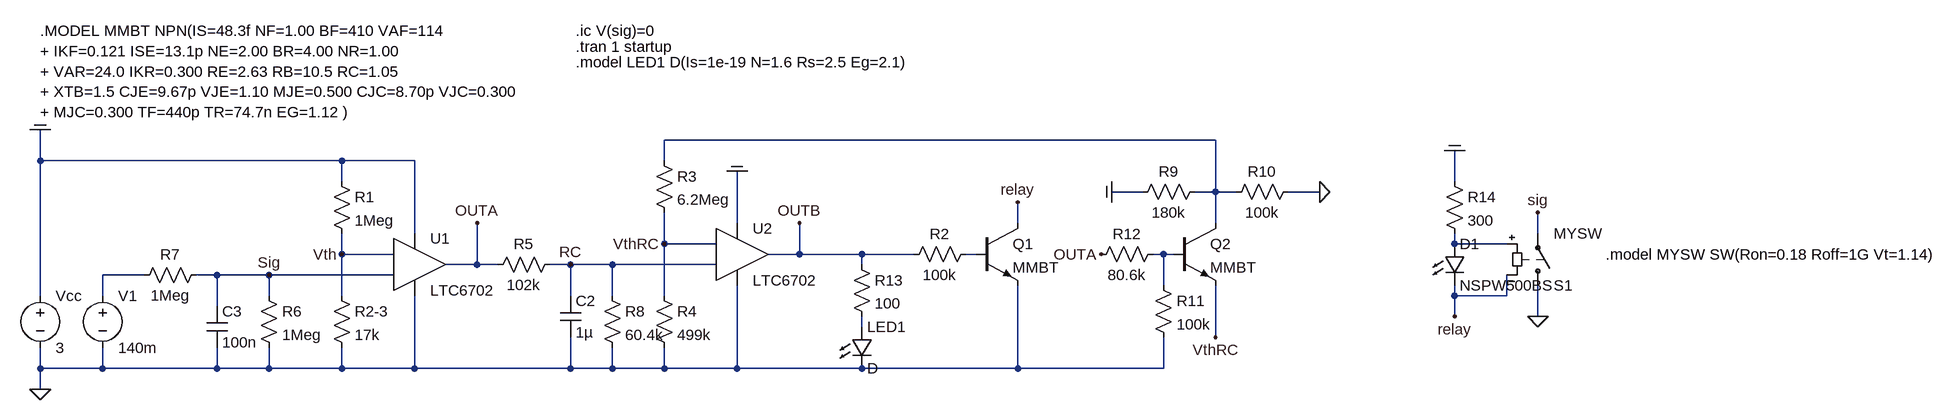
[diagram p0: schematic Windchill01.asc]
Windchill01.asc, the LTspice schematic file:
Version 4
SHEET 1 2700 680
WIRE 1456 -48 608 -48
WIRE -352 -16 -352 -64
WIRE 112 -16 -352 -16
WIRE 224 -16 112 -16
WIRE 608 -16 608 -48
WIRE 112 16 112 -16
WIRE 1824 16 1824 -32
WIRE 1344 32 1296 32
WIRE 1456 32 1456 -48
WIRE 1456 32 1424 32
WIRE 1488 32 1456 32
WIRE 1616 32 1568 32
WIRE 720 80 720 0
WIRE 1152 80 1152 48
WIRE 1456 80 1456 32
WIRE 224 96 224 -16
WIRE 1952 96 1952 64
WIRE 608 112 608 64
WIRE 688 112 608 112
WIRE 1824 112 1824 96
WIRE 1904 112 1824 112
WIRE 112 128 112 96
WIRE 192 128 112 128
WIRE 816 128 816 80
WIRE 816 128 768 128
WIRE 912 128 816 128
WIRE 992 128 912 128
WIRE 1088 128 1072 128
WIRE 1376 128 1360 128
WIRE 1392 128 1376 128
WIRE 320 144 320 80
WIRE 320 144 272 144
WIRE 352 144 320 144
WIRE 464 144 432 144
WIRE 528 144 464 144
WIRE 688 144 528 144
WIRE 912 144 912 128
WIRE -192 160 -256 160
WIRE -80 160 -112 160
WIRE 0 160 -80 160
WIRE 192 160 0 160
WIRE 1376 176 1376 128
WIRE -352 192 -352 -16
WIRE -256 192 -256 160
WIRE 0 192 0 160
WIRE 112 192 112 128
WIRE 464 192 464 144
WIRE 528 192 528 144
WIRE 608 192 608 112
WIRE 1824 192 1824 176
WIRE 1904 192 1904 160
WIRE 1904 192 1824 192
WIRE -80 208 -80 160
WIRE 1824 224 1824 192
WIRE 1952 224 1952 176
WIRE 912 240 912 224
WIRE 1456 256 1456 176
WIRE -352 304 -352 272
WIRE -256 304 -256 272
WIRE -256 304 -352 304
WIRE -80 304 -80 272
WIRE -80 304 -256 304
WIRE 0 304 0 272
WIRE 0 304 -80 304
WIRE 112 304 112 272
WIRE 112 304 0 304
WIRE 224 304 224 192
WIRE 224 304 112 304
WIRE 464 304 464 256
WIRE 464 304 224 304
WIRE 528 304 528 272
WIRE 528 304 464 304
WIRE 608 304 608 272
WIRE 608 304 528 304
WIRE 720 304 720 176
WIRE 720 304 608 304
WIRE 912 304 720 304
WIRE 1152 304 1152 176
WIRE 1152 304 912 304
WIRE 1376 304 1376 256
WIRE 1376 304 1152 304
WIRE -352 336 -352 304
FLAG -352 -64 COM
FLAG -352 336 0
FLAG 112 128 Vth
FLAG 608 112 VthRC
FLAG 0 160 Sig
FLAG 1456 256 VthRC
FLAG 320 80 OUTA
FLAG 816 80 OUTB
FLAG 1280 128 OUTA
FLAG 464 144 RC
FLAG 1616 32 0
FLAG 1296 32 COM
FLAG 720 0 COM
FLAG 1152 48 relay
FLAG 1952 224 0
FLAG 1952 64 sig
FLAG 1824 224 relay
FLAG 1824 -32 COM
SYMBOL cap 448 192 R0
SYMATTR InstName C2
SYMATTR Value 1µ
SYMBOL res 96 0 R0
SYMATTR InstName R1
SYMATTR Value 1Meg
SYMBOL res 96 176 R0
SYMATTR InstName R2-3
SYMATTR Value 17k
SYMBOL voltage -352 176 R0
WINDOW 123 0 0 Left 2
WINDOW 39 0 0 Left 2
SYMATTR InstName Vcc
SYMATTR Value 3
SYMBOL res 592 -32 R0
SYMATTR InstName R3
SYMATTR Value 6.2Meg
SYMBOL res 592 176 R0
SYMATTR InstName R4
SYMATTR Value 499k
SYMBOL res 336 160 R270
WINDOW 0 32 56 VTop 2
WINDOW 3 0 56 VBottom 2
SYMATTR InstName R5
SYMATTR Value 102k
SYMBOL Comparators\\LTC6702 224 144 R0
SYMATTR InstName U1
SYMBOL Comparators\\LTC6702 720 128 R0
SYMATTR InstName U2
SYMBOL Infineon-RFTransistor-SPICE.lib-SM-v02_10-EN\\npn 1088 80 R0
SYMATTR InstName Q1
SYMATTR Value MMBT
SYMBOL res 976 144 R270
WINDOW 0 32 56 VTop 2
WINDOW 3 0 56 VBottom 2
SYMATTR InstName R2
SYMATTR Value 100k
SYMBOL voltage -256 176 R0
WINDOW 123 0 0 Left 2
WINDOW 39 0 0 Left 2
SYMATTR InstName V1
SYMATTR Value 140m
SYMBOL res -208 176 R270
WINDOW 0 32 56 VTop 2
WINDOW 3 0 56 VBottom 2
SYMATTR InstName R7
SYMATTR Value 1Meg
SYMBOL cap -96 208 R0
SYMATTR InstName C3
SYMATTR Value 100n
SYMBOL res -16 176 R0
SYMATTR InstName R6
SYMATTR Value 1Meg
SYMBOL Infineon-RFTransistor-SPICE.lib-SM-v02_10-EN\\npn 1392 80 R0
SYMATTR InstName Q2
SYMATTR Value MMBT
SYMBOL res 1328 48 R270
WINDOW 0 32 56 VTop 2
WINDOW 3 0 56 VBottom 2
SYMATTR InstName R9
SYMATTR Value 180k
SYMBOL res 1472 48 R270
WINDOW 0 32 56 VTop 2
WINDOW 3 0 56 VBottom 2
SYMATTR InstName R10
SYMATTR Value 100k
SYMBOL res 512 176 R0
SYMATTR InstName R8
SYMATTR Value 60.4k
SYMBOL res 1360 160 R0
SYMATTR InstName R11
SYMATTR Value 100k
SYMBOL res 1264 144 R270
WINDOW 0 32 56 VTop 2
WINDOW 3 0 56 VBottom 2
SYMATTR InstName R12
SYMATTR Value 80.6k
SYMBOL LED 896 240 R0
SYMATTR InstName LED1
SYMBOL res 896 128 R0
SYMATTR InstName R13
SYMATTR Value 100
SYMBOL sw 1952 192 M180
SYMATTR InstName S1
SYMATTR Value MYSW
SYMBOL LED 1808 112 R0
SYMATTR InstName D1
SYMATTR Value NSPW500BS
SYMBOL res 1808 0 R0
SYMATTR InstName R14
SYMATTR Value 300
TEXT 472 -192 Left 2 !.tran 1 startup
TEXT -352 -216 Left 2 !.MODEL MMBT NPN(IS=48.3f NF=1.00 BF=410 VAF=114\n+ IKF=0.121 ISE=13.1p NE=2.00 BR=4.00 NR=1.00\n+ VAR=24.0 IKR=0.300 RE=2.63 RB=10.5 RC=1.05\n+ XTB=1.5 CJE=9.67p VJE=1.10 MJE=0.500 CJC=8.70p VJC=0.300\n+ MJC=0.300 TF=440p TR=74.7n EG=1.12 )
TEXT 472 -216 Left 2 !.ic V(sig)=0
TEXT 472 -168 Left 2 !.model LED1 D(Is=1e-19 N=1.6 Rs=2.5 Eg=2.1)
TEXT 2056 128 Left 2 !.model MYSW SW(Ron=0.18 Roff=1G Vt=1.14)

The netlist it stands for:
* Windchill01.asc
C2 RC 0 1µ
R1 COM Vth 1Meg
R2-3 Vth 0 17k
Vcc COM 0 3
R3 N001 VthRC 6.2Meg
R4 VthRC 0 499k
R5 OUTA RC 102k
XU1 Sig Vth COM 0 OUTA LTC6702
XU2 RC VthRC COM 0 OUTB LTC6702
Q1 relay N003 0 0 MMBT
R2 OUTB N003 100k
V1 N005 0 140m
R7 N005 Sig 1Meg
C3 Sig 0 100n
R6 Sig 0 1Meg
Q2 N001 N004 VthRC 0 MMBT
R9 COM N001 180k
R10 N001 0 100k
R8 RC 0 60.4k
R11 N004 0 100k
R12 OUTA N004 80.6k
D§LED1 N006 0 D
R13 OUTB N006 100
S1 0 Sig N002 relay MYSW
D1 N002 relay NSPW500BS
R14 COM N002 300
.model D D
.lib standard.dio
.model NPN NPN
.model PNP PNP
.lib standard.bjt
.tran 1 startup
.MODEL MMBT NPN(IS=48.3f NF=1.00 BF=410 VAF=114
+ IKF=0.121 ISE=13.1p NE=2.00 BR=4.00 NR=1.00
+ VAR=24.0 IKR=0.300 RE=2.63 RB=10.5 RC=1.05
+ XTB=1.5 CJE=9.67p VJE=1.10 MJE=0.500 CJC=8.70p VJC=0.300
+ MJC=0.300 TF=440p TR=74.7n EG=1.12 )
.ic V(sig)=0
.model LED1 D(Is=1e-19 N=1.6 Rs=2.5 Eg=2.1)
.model MYSW SW(Ron=0.18 Roff=1G Vt=1.14)
.lib LTC3.lib
.backanno
.end

* Results of the author's LTspice run, read from the files saved beside the schematic
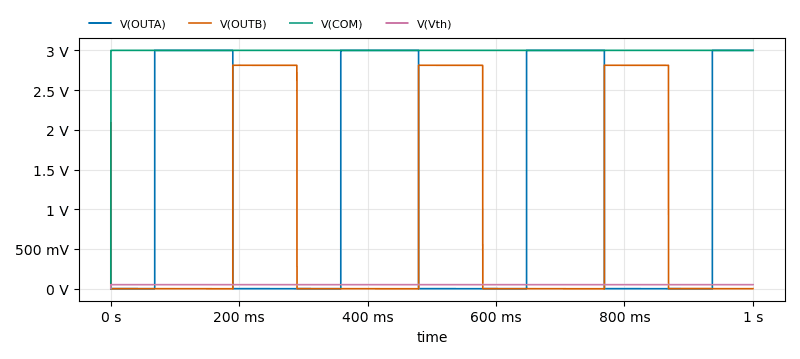
[diagram p1: Transient Analysis of Windchill01.asc, plotted from the saved traces]
* Transient Analysis, 1 run:
*   V(OUTA): min -1.847 mV, max 3 V, average 1.281 V, rms 1.96 V, last 3 V
*   V(OUTB): min -1.753 mV, max 2.813 V, average 842.2 mV, rms 1.539 V, last 0 V
*   V(COM): min 0 V, max 3 V, average 3 V, rms 3 V, last 3 V
*   V(Vth): min 0 V, max 50.63 mV, average 50.15 mV, rms 50.15 mV, last 50.15 mV